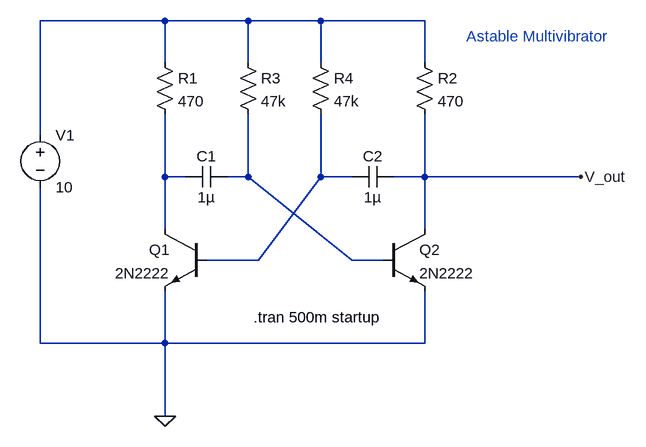
[diagram p0: schematic Astable_Multivibrator.asc]
Astable_Multivibrator.asc, the LTspice schematic file:
Version 4.1
SHEET 1 880 680
WIRE 48 -160 -144 -160
WIRE 176 -160 48 -160
WIRE 288 -160 176 -160
WIRE 448 -160 288 -160
WIRE 48 -96 48 -160
WIRE 176 -96 176 -160
WIRE 288 -96 288 -160
WIRE 448 -96 448 -160
WIRE -144 16 -144 -160
WIRE 48 80 48 -16
WIRE 80 80 48 80
WIRE 176 80 176 -16
WIRE 176 80 144 80
WIRE 288 80 288 -16
WIRE 336 80 288 80
WIRE 448 80 448 -16
WIRE 448 80 400 80
WIRE 688 80 448 80
WIRE 48 160 48 80
WIRE 448 160 448 80
WIRE 192 208 288 80
WIRE 192 208 112 208
WIRE 336 208 176 80
WIRE 384 208 336 208
WIRE -144 336 -144 96
WIRE 48 336 48 256
WIRE 48 336 -144 336
WIRE 448 336 448 256
WIRE 448 336 48 336
WIRE 48 448 48 336
FLAG 48 448 0
FLAG 688 80 V_out
SYMBOL npn 112 160 M0
SYMATTR InstName Q1
SYMATTR Value 2N2222
SYMBOL npn 384 160 R0
SYMATTR InstName Q2
SYMATTR Value 2N2222
SYMBOL voltage -144 0 R0
WINDOW 123 0 0 Left 0
WINDOW 39 0 0 Left 0
SYMATTR InstName V1
SYMATTR Value 10
SYMBOL res 32 -112 R0
SYMATTR InstName R1
SYMATTR Value 470
SYMBOL res 432 -112 R0
SYMATTR InstName R2
SYMATTR Value 470
SYMBOL res 160 -112 R0
SYMATTR InstName R3
SYMATTR Value 47k
SYMBOL res 272 -112 R0
SYMATTR InstName R4
SYMATTR Value 47k
SYMBOL cap 144 64 R90
WINDOW 0 0 32 VBottom 2
WINDOW 3 32 32 VTop 2
SYMATTR InstName C1
SYMATTR Value 1µ
SYMBOL cap 400 64 R90
WINDOW 0 0 32 VBottom 2
WINDOW 3 32 32 VTop 2
SYMATTR InstName C2
SYMATTR Value 1µ
TEXT 184 296 Left 2 !.tran 500m startup
TEXT 512 -136 Left 2 ;Astable Multivibrator

The netlist it stands for:
* Astable_Multivibrator.asc
Q1 N002 N004 0 0 2N2222
Q2 V_out N003 0 0 2N2222
V1 N001 0 10
R1 N001 N002 470
R2 N001 V_out 470
R3 N001 N003 47k
R4 N001 N004 47k
C1 N003 N002 1µ
C2 V_out N004 1µ
.model NPN NPN
.model PNP PNP
.lib standard.bjt
.tran 500m startup
* Astable Multivibrator
.backanno
.end